# Altium project ESP32_RS232.PrjPcb
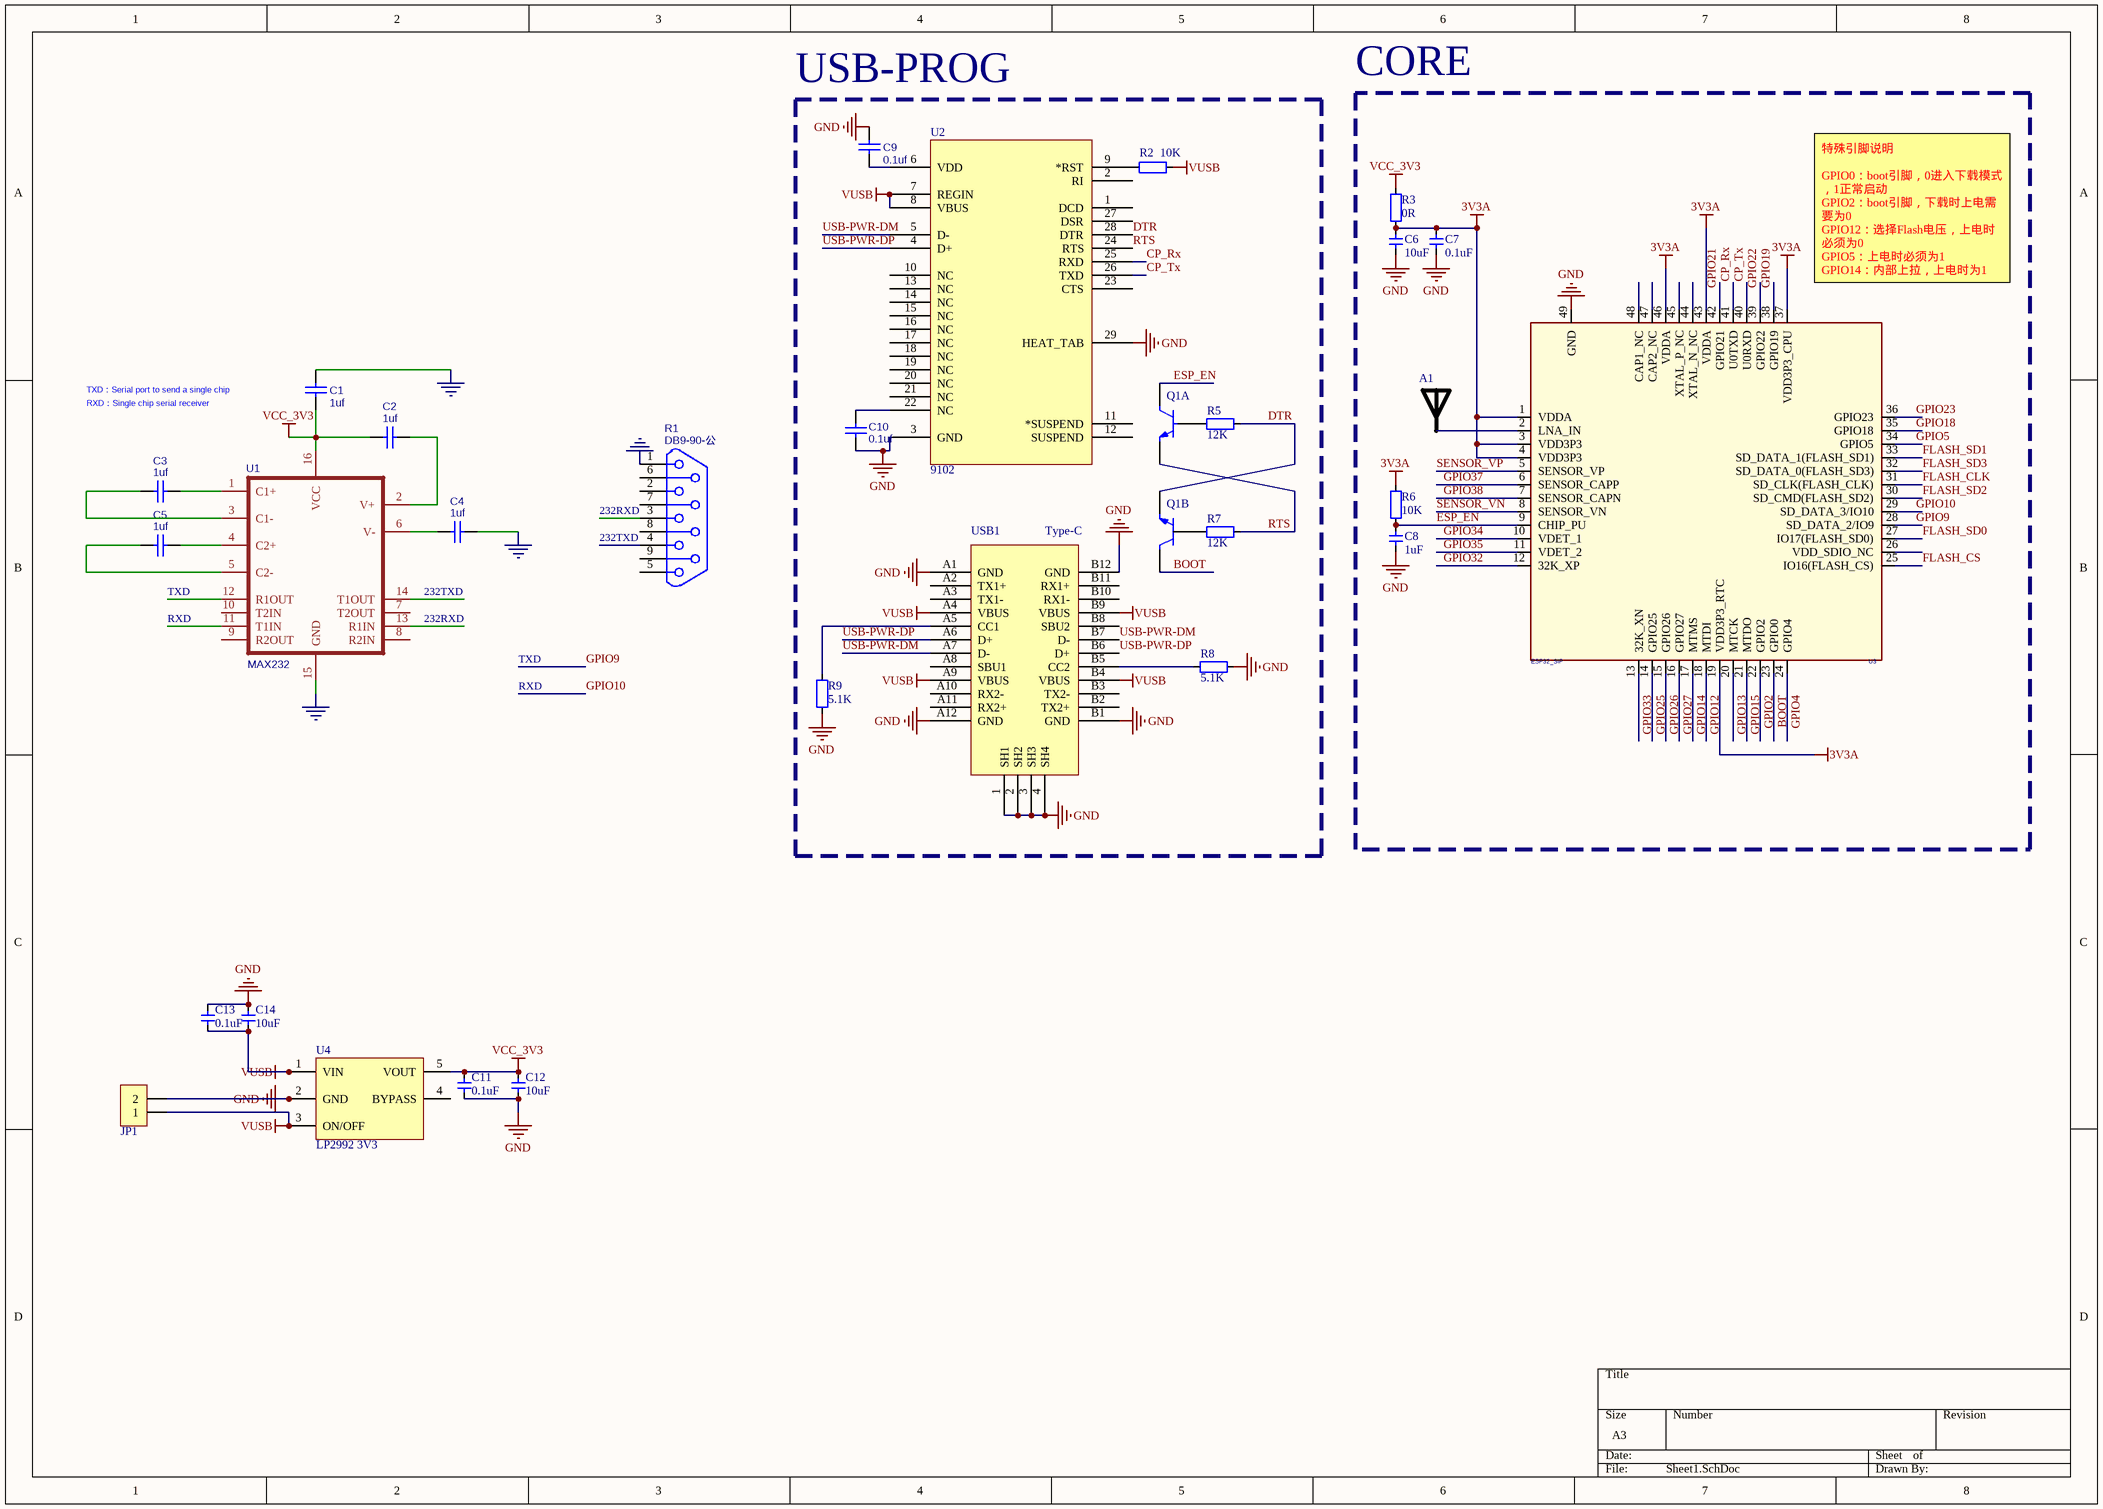
[diagram p0: Sheet1.SchDoc]
1 sheet, 30 parts. Net scope: global (net labels, ports and power ports of the same name join across sheets).
Board file: PCB1.PcbDoc

## Sheet Sheet1.SchDoc
size A3; SheetNumber: 1; SheetTotal: 1

### Parts
A1  RAINSUN  [ANT-Rainsun-AN5120]  (value not drawn)
C1  1uf  [C0402_M]
C2  1uf  [C0402_M]
C3  1uf  [C0402_M]
C4  1uf  [C0402_M]
C5  1uf  [C0402_M]
C6  10uF  [CAP_0402]
C7  0.1uF  [CAP_0402]
C8  1uF  [CAP_0402]
C9  0.1uf  [C0402_M]
C10  0.1uf  [C0402_M]
C11  0.1uF  [CAP_0402]
C12  10uF  [CAP_0402]
C13  0.1uF  [CAP_0402]
C14  10uF  [CAP_0402]
JP1  HDR-1X2  [XH2.54-LI-2P]  (value not drawn)
Q1  BC847BVC-7  [SOT563-6]  (value not drawn)  (parts A,B of 2)
R1  DB9-90-公  [DSUB-TH_FDB0901-M0DB300K6KF]
R2  10K  [RES_0402]
R3  0R  [RES_0402]
R5  12K  [RES_0402]
R6  10K  [RES_0402]
R7  12K  [RES_0402]
R8  5.1K  [RES_0402]
R9  5.1K  [RES_0402]
U1  MAX232  [SO16]
U2  9102  [QFN-28]
U3  ESP32_SIP  [QFN-48_7X7]
U4  LP2992 3V3  [SOT23-5]
USB1  Type-C  [Type-C-TOP]

### Blocks framed on the sheet
USB-PROG: C9 C10 Q1 R2 R5 R7-R9 U2 USB1

### Nets
3V3A: C6.2 C7.2 R3.2 R6.1 U3.1(VDDA) U3.3(VDD3P3) U3.4(VDD3P3) U3.19(VDD3P3_RTC) U3.37(VDD3P3_CPU) U3.43(VDDA) U3.46(VDDA)
GND: C1.1 C4.1 C6.1 C7.1 C8.2 C9.1 C10.1 C11.1 C12.1 C13.2 C14.2 JP1.2 R1.1 R8.1 R9.2 U1.15(GND) U2.3(GND) U2.29(HEAT_TAB) U3.49(GND) U4.2(GND) USB1.1(SH1) USB1.2(SH2) USB1.3(SH3) USB1.4(SH4) USB1.A1(GND) USB1.A12(GND) USB1.B1(GND) USB1.B12(GND)
VCC_3V3: C1.2 C2.2 C11.2 C12.2 R3.1 U1.16(VCC) U4.5(VOUT)
VUSB: C13.1 C14.1 JP1.1 R2.1 U2.7(REGIN) U2.8(VBUS) U4.1(VIN) U4.3(ON/OFF) USB1.A4(VBUS) USB1.A9(VBUS) USB1.B4(VBUS) USB1.B9(VBUS)
232RXD: R1.3 U1.13(R1IN)
232TXD: R1.4 U1.14(T1OUT)
BOOT: Q1.3(C2) U3.23(GPIO0)
CP_Rx: U2.25(RXD) U3.41(U0TXD)
CP_Tx: U2.26(TXD) U3.40(U0RXD)
DTR: Q1.4(E2) R5.1 U2.28(DTR)
ESP_EN: C8.1 Q1.6(C1) R6.2 U3.9(CHIP_PU)
FLASH_CLK: U3.31(SD_CLK(FLASH_CLK))
FLASH_CS: U3.25(IO16(FLASH_CS))
FLASH_SD0: U3.27(IO17(FLASH_SD0))
FLASH_SD1: U3.33(SD_DATA_1(FLASH_SD1))
FLASH_SD2: U3.30(SD_CMD(FLASH_SD2))
FLASH_SD3: U3.32(SD_DATA_0(FLASH_SD3))
GPIO2: U3.22(GPIO2)
GPIO4: U3.24(GPIO4)
GPIO5: U3.34(GPIO5)
GPIO9: U1.12(R1OUT) U3.28(SD_DATA_2/IO9)  [also labelled TXD]
GPIO10: U1.11(T1IN) U3.29(SD_DATA_3/IO10)  [also labelled RXD]
GPIO12: U3.18(MTDI)
GPIO13: U3.20(MTCK)
GPIO14: U3.17(MTMS)
GPIO15: U3.21(MTDO)
GPIO18: U3.35(GPIO18)
GPIO19: U3.38(GPIO19)
GPIO21: U3.42(GPIO21)
GPIO22: U3.39(GPIO22)
GPIO23: U3.36(GPIO23)
GPIO25: U3.14(GPIO25)
GPIO26: U3.15(GPIO26)
GPIO27: U3.16(GPIO27)
GPIO32: U3.12(32K_XP)
GPIO33: U3.13(32K_XN)
GPIO34: U3.10(VDET_1)
GPIO35: U3.11(VDET_2)
GPIO37: U3.6(SENSOR_CAPP)
GPIO38: U3.7(SENSOR_CAPN)
RTS: Q1.1(E1) R7.1 U2.24(RTS)
SENSOR_VN: U3.8(SENSOR_VN)
SENSOR_VP: U3.5(SENSOR_VP)
USB-PWR-DM: U2.5(D-) USB1.A7(D-) USB1.B7(D-)
USB-PWR-DP: U2.4(D+) USB1.A6(D+) USB1.B6(D+)
NetA1_1: A1.1 U3.2(LNA_IN)
NetC2_1: C2.1 U1.2(V+)
NetC3_1: C3.1 U1.1(C1+)
NetC3_2: C3.2 U1.3(C1-)
NetC4_2: C4.2 U1.6(V-)
NetC5_1: C5.1 U1.4(C2+)
NetC5_2: C5.2 U1.5(C2-)
NetC9_2: C9.2 U2.6(VDD)
NetC10_2: C10.2 U2.22(NC)
NetQ1_2: Q1.2(B1) R5.2
NetQ1_5: Q1.5(B2) R7.2
NetR2_2: R2.2 U2.9(*RST)
NetR8_2: R8.2 USB1.B5(CC2)
NetR9_1: R9.1 USB1.A5(CC1)

Not connected (* = marked no-connect by the designer): R1 2 5 6 7 8 9; U1 7(T2OUT) 8(R2IN) 9(R2OUT) 10(T2IN); U2 1(DCD) 2(RI) 10(NC) 11(*SUSPEND) 12(SUSPEND) 13(NC) 14(NC) 15(NC) 16(NC) 17(NC) 18(NC) 19(NC) 20(NC) 21(NC) 23(CTS) 27(DSR); U3 26(VDD_SDIO_NC) 44(XTAL_N_NC) 45(XTAL_P_NC) 47(CAP2_NC) 48(CAP1_NC); U4 4(BYPASS); USB1 A2(TX1+) A3(TX1-) A8(SBU1) A10(RX2-) A11(RX2+) B2(TX2+) B3(TX2-) B8(SBU2) B10(RX1-) B11(RX1+)

### Notes on the sheet
- CORE
- (near U3) 特殊引脚说明
  GPIO0：boot引脚，0进入下载模式，1正常启动
  GPIO2：boot引脚，下载时上电需要为0
  GPIO12：选择Flash电压，上电时必须为0
  GPIO5：上电时必须为1
  GPIO14：内部上拉，上电时为1
  GPIO15：上电时必须为1
- TXD：Serial port to send a single chip
- RXD：Single chip serial receiver

### Library data of the parts
A1 = ANT-Rainsun-AP5120
C1-C5 C9 C10 = 1uf: catid: 20; sourceId: aYgasJ1jB; timeStamp: 1452930407; BOM_Manufacturer Part: ?; spicePre: C
C6-C8 C11-C14 = 电容-0402: Capacitor; Value: 0.1u
JP1 = Header 2: 2P接插件; 联系卖家，免费查找封装: 唯一出售店铺网址https://shop463601444.taobao.com; 封装库来自淘宝卖家ID：黄晶宝石: 其他店铺购入均为盗版封装库，请立即申请退款，本店现金奖励50~200元; BOM名称: 2P接插件
R1 = DB9-90-公: catid: 20; sourceId: I20wqkZTb; timeStamp: 1457058529; BOM_Manufacturer Part: ?; spicePre: R
R2 R3 R5-R9 = 电阻-0402: Resistor; Value: 22R
U1 = MAX232: catid: 20; Contributor: SparkFun; sourceId: xvpHBTbtm; timeStamp: 1459220747; BOM_Manufacturer Part: ?; spicePre: U
U2 = CP2102: USB转TTL; PART DESC: SINGLE-CHIP USB TO UART BRIDGE, QFN28, RoHS.; MFG #1: SILICON LABS; PART NUMBER: CP2102; Value: Value; RefDes: RefDes; Type: DEV
U3 = ESP32-PICO
U4 = LP2992: LDO
USB1 = USB-Type-C-TOP